# EAGLE schematic dashboard (EAGLE 9.5.1)
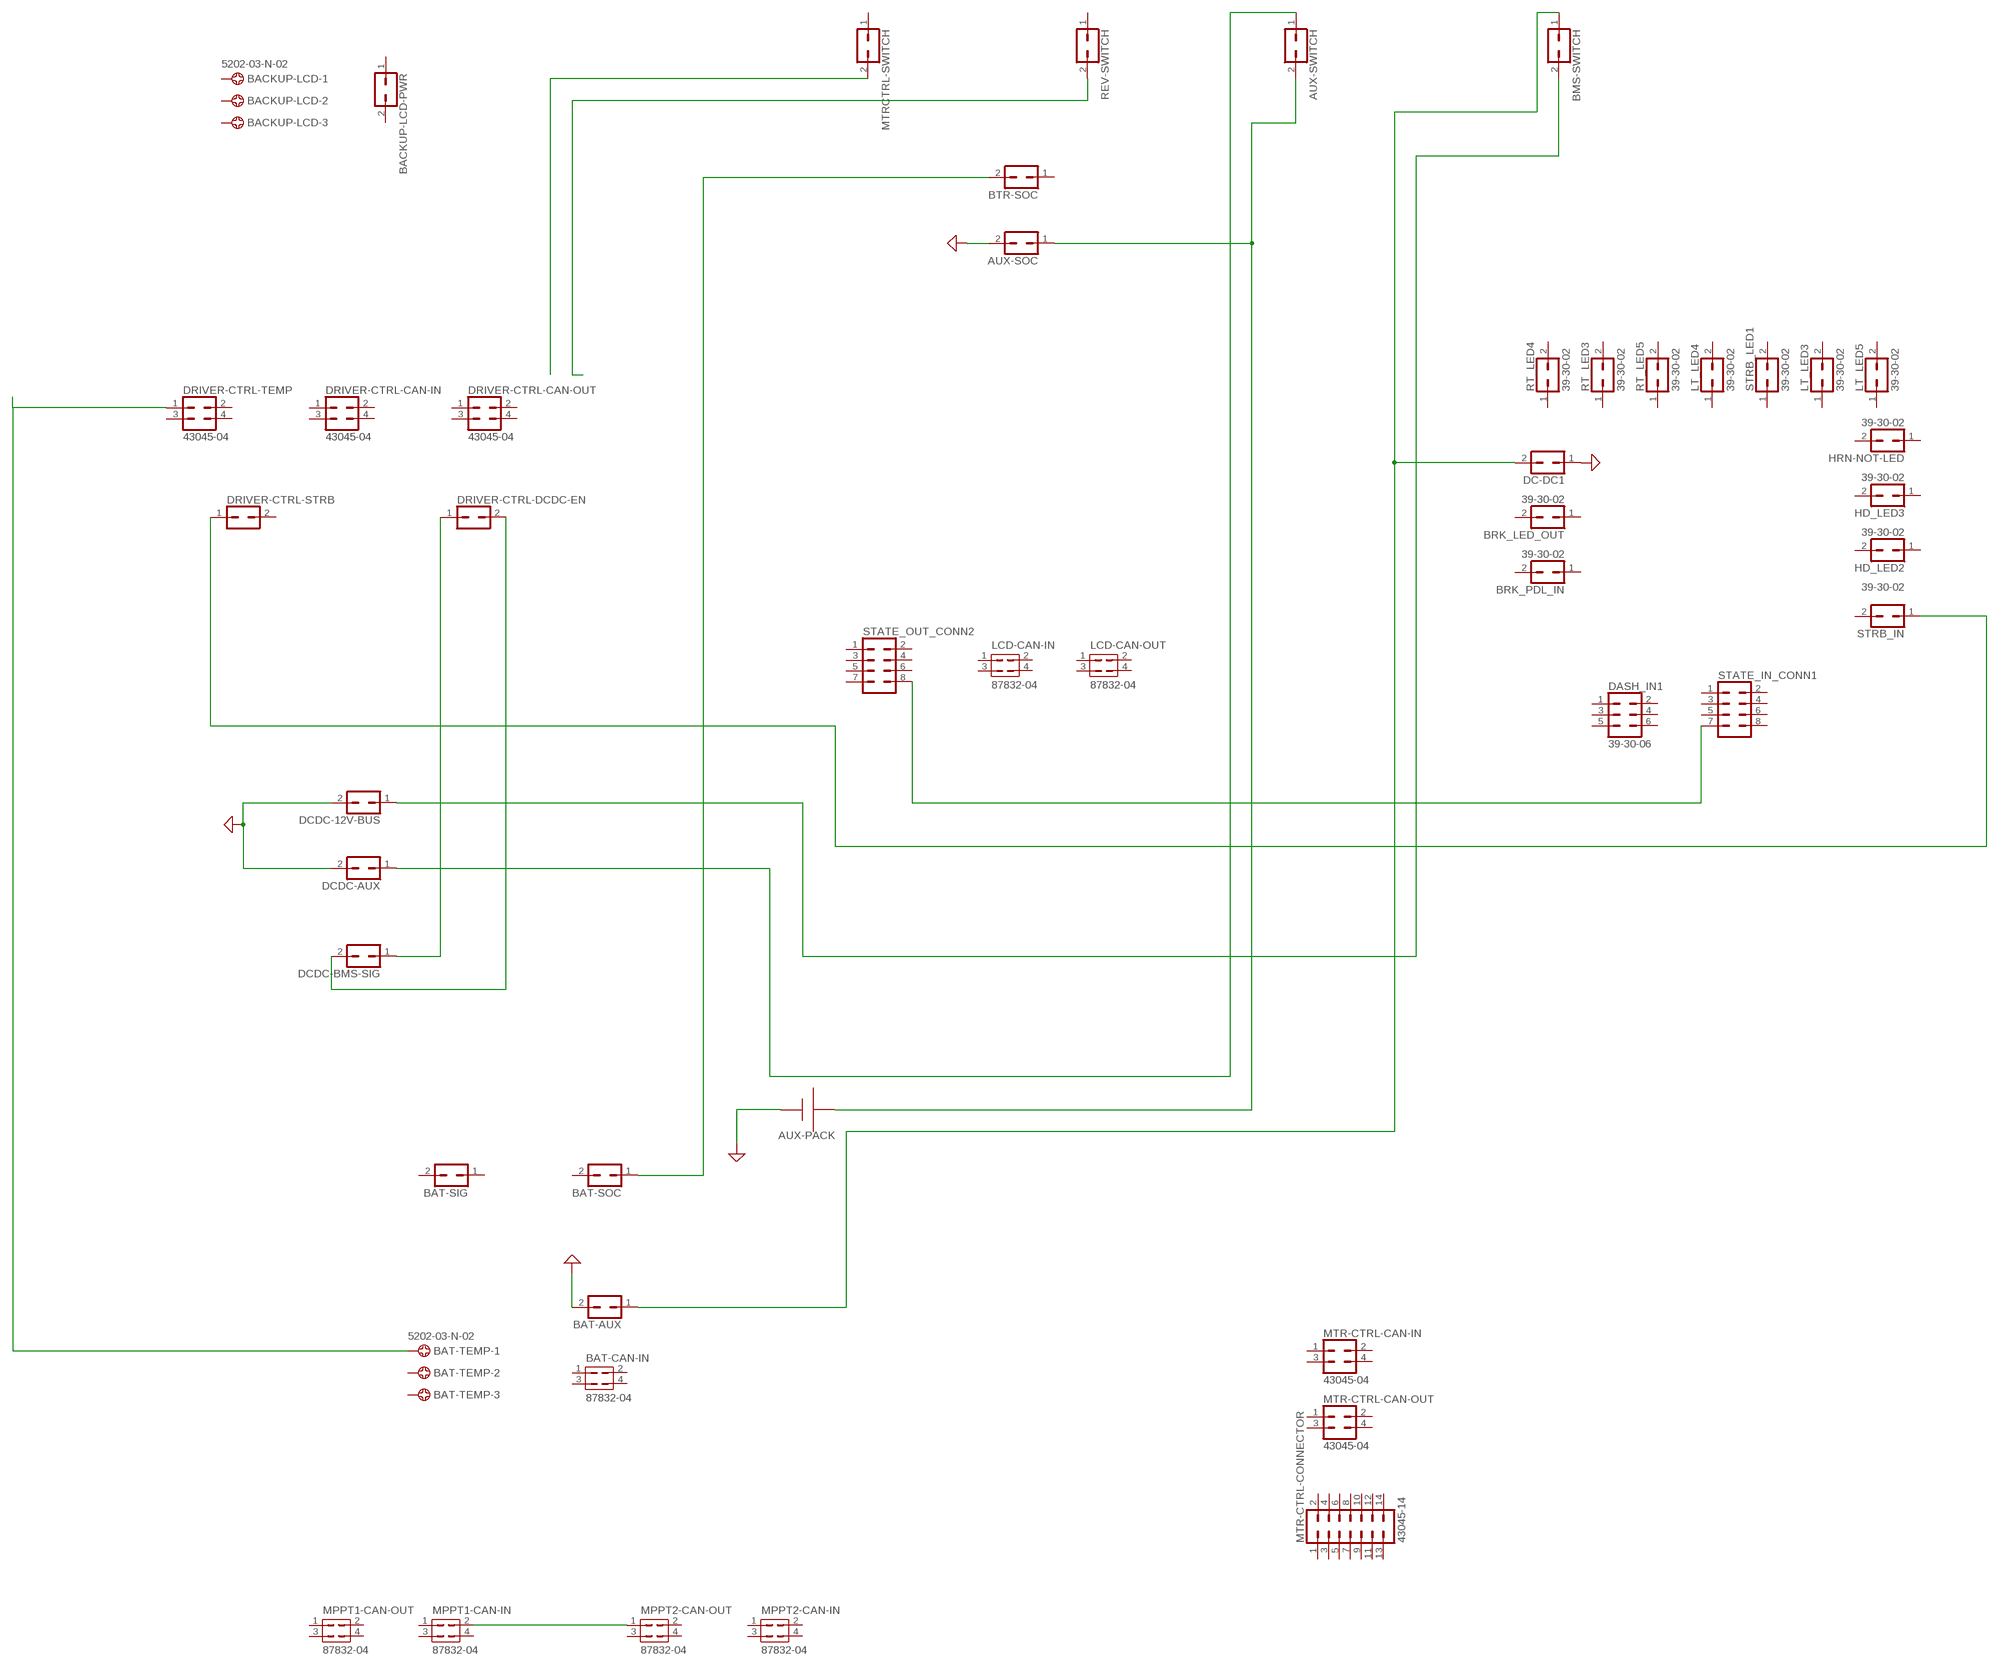
[diagram p0: schematic, sheet 1]

## Parts
AUX-PACK  AAA  [12BH412]
AUX-SOC  39-30-02  [39-30-?02?]
AUX-SWITCH  39-30-02  [39-30-?02?]
BACKUP-LCD  5202-03-N-02  [5202-03-N-02]
BACKUP-LCD-PWR  39-30-02  [39-30-?02?]
BAT-AUX  39-30-02  [39-30-?02?]
BAT-CAN-IN  87832-04  [87832-04]
BAT-SIG  39-30-02  [39-30-?02?]
BAT-SOC  39-30-02  [39-30-?02?]
BAT-TEMP  5202-03-N-02  [5202-03-N-02]
BMS-SWITCH  39-30-02  [39-30-?02?]
BRK_LED_OUT  39-30-02  [39-30-?02?]
BRK_PDL_IN  39-30-02  [39-30-?02?]
BTR-SOC  39-30-02  [39-30-?02?]
DASH_IN1  39-30-06  [39-30-?06?]
DC-DC1  39-30-02  [39-30-?02?]
DCDC-12V-BUS  39-30-02  [39-30-?02?]
DCDC-AUX  39-30-02  [39-30-?02?]
DCDC-BMS-SIG  39-30-02  [39-30-?02?]
DRIVER-CTRL-CAN-IN  43045-04  [43045-04]
DRIVER-CTRL-CAN-OUT  43045-04  [43045-04]
DRIVER-CTRL-DCDC-EN  43045-02  [43045-02]
DRIVER-CTRL-STRB  43045-02  [43045-02]
DRIVER-CTRL-TEMP  43045-04  [43045-04]
HD_LED2  39-30-02  [39-30-?02?]
HD_LED3  39-30-02  [39-30-?02?]
HRN-NOT-LED  39-30-02  [39-30-?02?]
LCD-CAN-IN  87832-04  [87832-04]
LCD-CAN-OUT  87832-04  [87832-04]
LT_LED3  39-30-02  [39-30-?02?]
LT_LED4  39-30-02  [39-30-?02?]
LT_LED5  39-30-02  [39-30-?02?]
MPPT1-CAN-IN  87832-04  [87832-04]
MPPT1-CAN-OUT  87832-04  [87832-04]
MPPT2-CAN-IN  87832-04  [87832-04]
MPPT2-CAN-OUT  87832-04  [87832-04]
MTR-CTRL-CAN-IN  43045-04  [43045-04]
MTR-CTRL-CAN-OUT  43045-04  [43045-04]
MTR-CTRL-CONNECTOR  43045-14  [43045-14]
MTRCTRL-SWITCH  39-30-02  [39-30-?02?]
REV-SWITCH  39-30-02  [39-30-?02?]
RT_LED3  39-30-02  [39-30-?02?]
RT_LED4  39-30-02  [39-30-?02?]
RT_LED5  39-30-02  [39-30-?02?]
STATE_IN_CONN1  39-30-08  [39-30-?08?]
STATE_OUT_CONN2  39-30-08  [39-30-?08?]
STRB_IN  39-30-02  [39-30-?02?]
STRB_LED1  39-30-02  [39-30-?02?]

## Nets
GND: AUX-PACK.+ AUX-SOC.2 BAT-AUX.2 DC-DC1.1 DCDC-12V-BUS.2 DCDC-AUX.2 ; supply symbol labelled SUP
N$1: STATE_IN_CONN1.7 STATE_OUT_CONN2.8
N$2: AUX-PACK.- AUX-SOC.1 AUX-SWITCH.2
N$3: BMS-SWITCH.2 DCDC-12V-BUS.1
N$4: AUX-SWITCH.1 DCDC-AUX.1
N$5: BAT-AUX.1 BMS-SWITCH.1 DC-DC1.2
N$6: MPPT1-CAN-IN.2 MPPT2-CAN-OUT.1
N$7: DCDC-BMS-SIG.1 DRIVER-CTRL-DCDC-EN.1
N$8: BAT-SOC.1 BTR-SOC.2
N$9: DCDC-BMS-SIG.2 DRIVER-CTRL-DCDC-EN.2
N$10: BAT-TEMP.1 DRIVER-CTRL-TEMP.1
N$11: DRIVER-CTRL-STRB.1 STRB_IN.1
N$12: MTRCTRL-SWITCH.2
N$13: REV-SWITCH.2
Unconnected: BACKUP-LCD-PWR.1 BACKUP-LCD-PWR.2 BACKUP-LCD.1 BACKUP-LCD.2 BACKUP-LCD.3 BAT-CAN-IN.1 BAT-CAN-IN.2 BAT-CAN-IN.3 BAT-CAN-IN.4 BAT-SIG.1 BAT-SIG.2 BAT-SOC.2 BAT-TEMP.2 BAT-TEMP.3 BRK_LED_OUT.1 BRK_LED_OUT.2 BRK_PDL_IN.1 BRK_PDL_IN.2 BTR-SOC.1 DASH_IN1.1 DASH_IN1.2 DASH_IN1.3 DASH_IN1.4 DASH_IN1.5 DASH_IN1.6 DRIVER-CTRL-CAN-IN.1 DRIVER-CTRL-CAN-IN.2 DRIVER-CTRL-CAN-IN.3 DRIVER-CTRL-CAN-IN.4 DRIVER-CTRL-CAN-OUT.1 DRIVER-CTRL-CAN-OUT.2 DRIVER-CTRL-CAN-OUT.3 DRIVER-CTRL-CAN-OUT.4 DRIVER-CTRL-STRB.2 DRIVER-CTRL-TEMP.2 DRIVER-CTRL-TEMP.3 DRIVER-CTRL-TEMP.4 HD_LED2.1 HD_LED2.2 HD_LED3.1 HD_LED3.2 HRN-NOT-LED.1 HRN-NOT-LED.2 LCD-CAN-IN.1 LCD-CAN-IN.2 LCD-CAN-IN.3 LCD-CAN-IN.4 LCD-CAN-OUT.1 LCD-CAN-OUT.2 LCD-CAN-OUT.3 LCD-CAN-OUT.4 LT_LED3.1 LT_LED3.2 LT_LED4.1 LT_LED4.2 LT_LED5.1 LT_LED5.2 MPPT1-CAN-IN.1 MPPT1-CAN-IN.3 MPPT1-CAN-IN.4 MPPT1-CAN-OUT.1 MPPT1-CAN-OUT.2 MPPT1-CAN-OUT.3 MPPT1-CAN-OUT.4 MPPT2-CAN-IN.1 MPPT2-CAN-IN.2 MPPT2-CAN-IN.3 MPPT2-CAN-IN.4 MPPT2-CAN-OUT.2 MPPT2-CAN-OUT.3 MPPT2-CAN-OUT.4 MTR-CTRL-CAN-IN.1 MTR-CTRL-CAN-IN.2 MTR-CTRL-CAN-IN.3 MTR-CTRL-CAN-IN.4 MTR-CTRL-CAN-OUT.1 MTR-CTRL-CAN-OUT.2 MTR-CTRL-CAN-OUT.3 MTR-CTRL-CAN-OUT.4 MTR-CTRL-CONNECTOR.1 MTR-CTRL-CONNECTOR.2 MTR-CTRL-CONNECTOR.3 MTR-CTRL-CONNECTOR.4 MTR-CTRL-CONNECTOR.5 MTR-CTRL-CONNECTOR.6 MTR-CTRL-CONNECTOR.7 MTR-CTRL-CONNECTOR.8 MTR-CTRL-CONNECTOR.9 MTR-CTRL-CONNECTOR.10 MTR-CTRL-CONNECTOR.11 MTR-CTRL-CONNECTOR.12 MTR-CTRL-CONNECTOR.13 MTR-CTRL-CONNECTOR.14 MTRCTRL-SWITCH.1 REV-SWITCH.1 RT_LED3.1 RT_LED3.2 RT_LED4.1 RT_LED4.2 RT_LED5.1 RT_LED5.2 STATE_IN_CONN1.1 STATE_IN_CONN1.2 STATE_IN_CONN1.3 STATE_IN_CONN1.4 STATE_IN_CONN1.5 STATE_IN_CONN1.6 STATE_IN_CONN1.8 STATE_OUT_CONN2.1 STATE_OUT_CONN2.2 STATE_OUT_CONN2.3 STATE_OUT_CONN2.4 STATE_OUT_CONN2.5 STATE_OUT_CONN2.6 STATE_OUT_CONN2.7 STRB_IN.2 STRB_LED1.1 STRB_LED1.2

## Library data of the parts
AUX-PACK = adafruit:AAA: AAA PC pin holder Mouser part #12BH412 - but pretty much any 1x AAA battery holder should be the same http://www.ladyada.net/library/pcb/eaglelibrary.html
AUX-SOC AUX-SWITCH BACKUP-LCD-PWR BAT-AUX BAT-SIG BAT-SOC BMS-SWITCH BRK_LED_OUT BRK_PDL_IN BTR-SOC DC-DC1 DCDC-12V-BUS DCDC-AUX DCDC-BMS-SIG HD_LED2 HD_LED3 HRN-NOT-LED LT_LED3-LT_LED5 MTRCTRL-SWITCH REV-SWITCH RT_LED3-RT_LED5 STRB_IN STRB_LED1 = con-molex-mini-fit:39-30-?02?: HEADER
BACKUP-LCD BAT-TEMP = con-ebyelectro:5202-03-N-02: Barrier Blocks Sreies 5202 Source: http://www.ebyelectro.com/PDF/5202-XX-N-02.pdf; OC_FARNELL: unknown; OC_NEWARK: unknown
BAT-CAN-IN LCD-CAN-IN LCD-CAN-OUT MPPT1-CAN-IN MPPT1-CAN-OUT MPPT2-CAN-IN MPPT2-CAN-OUT = con-molex:87832-04: Milli-Grid Header 2.00mm (.079") Pitch; MF: MOLEX; OC_FARNELL: unknown; OC_NEWARK: unknown
DASH_IN1 = con-molex-mini-fit:39-30-?06?: HEADER
DRIVER-CTRL-CAN-IN DRIVER-CTRL-CAN-OUT DRIVER-CTRL-TEMP MTR-CTRL-CAN-IN MTR-CTRL-CAN-OUT = con-molex-micro-fit:43045-04: HEADER
DRIVER-CTRL-DCDC-EN DRIVER-CTRL-STRB = con-molex-micro-fit:43045-02: HEADER
MTR-CTRL-CONNECTOR = con-molex-micro-fit:43045-14: HEADER
STATE_IN_CONN1 STATE_OUT_CONN2 = con-molex-mini-fit:39-30-?08?: HEADER